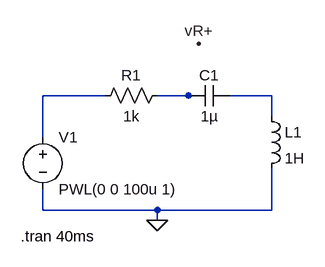
[diagram p0: schematic hw1_17.asc]
hw1_17.asc, the LTspice schematic file:
Version 4
SHEET 1 880 680
WIRE -368 -112 -464 -112
WIRE -240 -112 -288 -112
WIRE -224 -112 -240 -112
WIRE -112 -112 -176 -112
WIRE -112 -80 -112 -112
WIRE -464 -48 -464 -112
WIRE -464 64 -464 32
WIRE -288 64 -464 64
WIRE -112 64 -112 0
WIRE -112 64 -288 64
WIRE -288 80 -288 64
FLAG -288 80 0
FLAG -224 -192 vR+
SYMBOL voltage -464 -64 R0
WINDOW 123 0 0 Left 0
WINDOW 39 0 0 Left 0
SYMATTR InstName V1
SYMATTR Value PWL(0 0 100u 1)
SYMBOL res -272 -128 R90
WINDOW 0 0 56 VBottom 2
WINDOW 3 32 56 VTop 2
SYMATTR InstName R1
SYMATTR Value 1k
SYMBOL cap -176 -128 R90
WINDOW 0 0 32 VBottom 2
WINDOW 3 32 32 VTop 2
SYMATTR InstName C1
SYMATTR Value 1µ
SYMBOL ind -128 -96 R0
SYMATTR InstName L1
SYMATTR Value 1H
TEXT -498 104 Left 2 !.tran 40ms

The netlist it stands for:
* hw1_17.asc
V1 N001 0 PWL(0 0 100u 1)
R1 N002 N001 1k
C1 N003 N002 1µ
L1 N003 0 1H
.tran 40ms
.backanno
.end